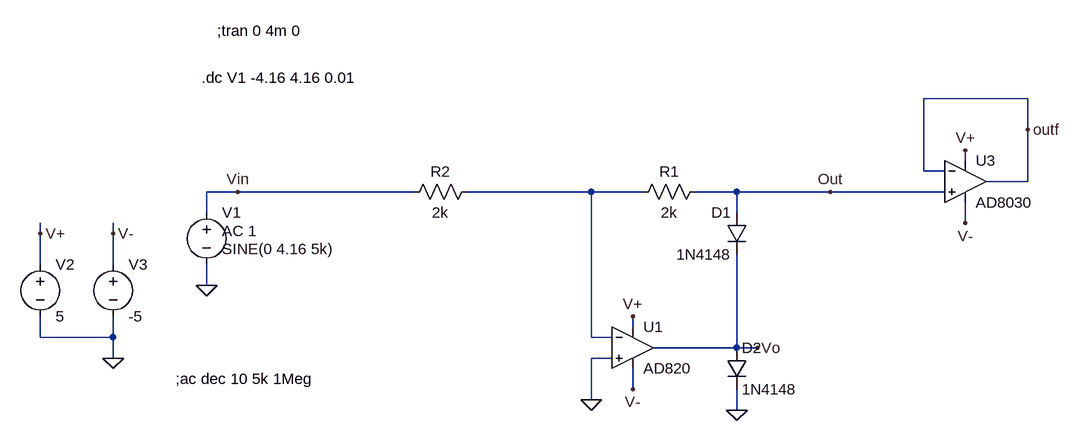
[diagram p0: schematic Etajul 4.asc]
Etajul 4.asc, the LTspice schematic file:
Version 4
SHEET 1 1624 680
WIRE 688 -416 528 -416
WIRE 688 -368 688 -416
WIRE 592 -320 592 -336
WIRE 528 -304 528 -416
WIRE 560 -304 528 -304
WIRE 688 -288 688 -368
WIRE 688 -288 624 -288
WIRE -528 -272 -576 -272
WIRE -256 -272 -528 -272
WIRE 16 -272 -176 -272
WIRE 96 -272 16 -272
WIRE 240 -272 176 -272
WIRE 384 -272 240 -272
WIRE 560 -272 384 -272
WIRE -576 -240 -576 -272
WIRE 240 -240 240 -272
WIRE 592 -224 592 -256
WIRE -832 -208 -832 -224
WIRE -720 -208 -720 -224
WIRE -832 -160 -832 -208
WIRE -720 -160 -720 -208
WIRE -576 -128 -576 -160
WIRE 80 -64 80 -80
WIRE -832 -48 -832 -80
WIRE -720 -48 -720 -80
WIRE -720 -48 -832 -48
WIRE 16 -48 16 -272
WIRE 48 -48 16 -48
WIRE 240 -32 240 -176
WIRE 240 -32 112 -32
WIRE 272 -32 240 -32
WIRE -720 -16 -720 -48
WIRE 48 -16 16 -16
WIRE 80 32 80 0
WIRE 16 48 16 -16
WIRE 240 64 240 32
FLAG -576 -128 0
FLAG -720 -16 0
FLAG -832 -208 V+
FLAG -720 -208 V-
FLAG -528 -272 Vin
FLAG 384 -272 Out
FLAG 16 48 0
FLAG 272 -32 Vo
FLAG 80 -80 V+
FLAG 80 32 V-
FLAG 240 64 0
FLAG 592 -336 V+
FLAG 592 -224 V-
FLAG 688 -368 outf
SYMBOL voltage -576 -256 R0
WINDOW 123 24 44 Left 2
WINDOW 39 0 0 Left 2
WINDOW 3 24 72 Left 2
SYMATTR Value2 AC 1
SYMATTR Value SINE(0 4.16 5k)
SYMATTR InstName V1
SYMBOL voltage -832 -176 R0
WINDOW 123 0 0 Left 2
WINDOW 39 0 0 Left 2
SYMATTR InstName V2
SYMATTR Value 5
SYMBOL voltage -720 -176 R0
WINDOW 123 0 0 Left 2
WINDOW 39 0 0 Left 2
SYMATTR InstName V3
SYMATTR Value -5
SYMBOL res -160 -288 R90
WINDOW 0 0 56 VBottom 2
WINDOW 3 32 56 VTop 2
SYMATTR InstName R2
SYMATTR Value 2k
SYMBOL res 192 -288 R90
WINDOW 0 0 56 VBottom 2
WINDOW 3 32 56 VTop 2
SYMATTR InstName R1
SYMATTR Value 2k
SYMBOL diode 256 -240 M0
SYMATTR InstName D1
SYMATTR Value 1N4148
SYMBOL diode 224 -32 R0
SYMATTR InstName D2
SYMATTR Value 1N4148
SYMBOL OpAmps\\AD8030 592 -352 R0
SYMATTR InstName U3
SYMBOL OpAmps\\AD820 80 -96 R0
SYMATTR InstName U1
TEXT -560 -520 Left 2 !;tran 0 4m 0
TEXT -584 -448 Left 2 !.dc V1 -4.16 4.16 0.01
TEXT -624 16 Left 2 !;ac dec 10 5k 1Meg

The netlist it stands for:
* Etajul 4.asc
V1 Vin 0 SINE(0 4.16 5k) AC 1
V2 V+ 0 5
V3 V- 0 -5
R2 N001 Vin 2k
R1 Out N001 2k
D1 Out Vo 1N4148
D2 Vo 0 1N4148
XU3 Out outf V+ V- outf AD8040  ; AD8030, pins In+ In- V+ V- OUT
XU1 0 N001 V+ V- Vo AD820  ; pins In+ In- V+ V- OUT
.model D D
.lib standard.dio
;tran 0 4m 0
.dc V1 -4.16 4.16 0.01
;ac dec 10 5k 1Meg
.lib ADI.lib
.backanno
.end